# EAGLE design USBasp_SMD (EAGLE 7.5.0)
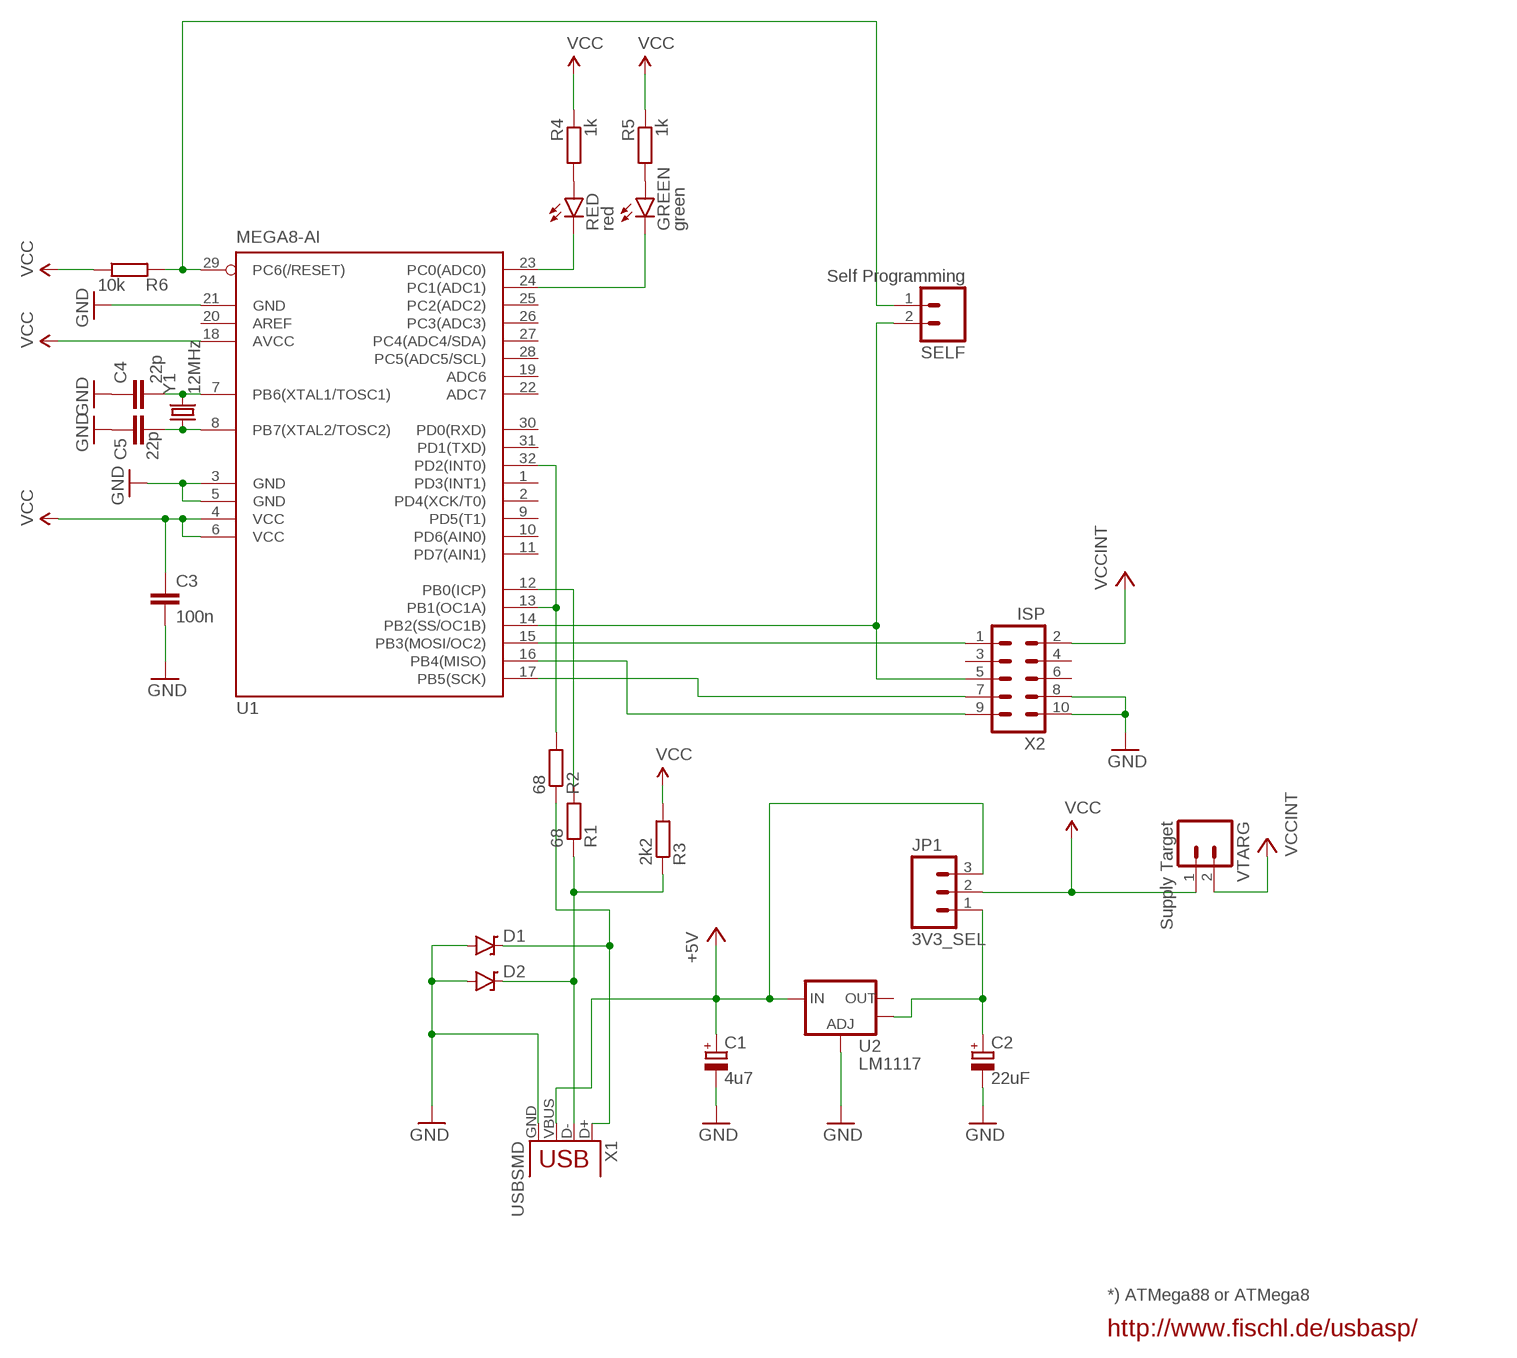
[diagram p0: schematic, sheet 1]

## Parts
C1  4u7  CPOL-EUE2.5-5  [E2,5-5]
C2  22uF  CPOL-EUE2.5-5  [E2,5-5]
C3  100n  C-EUC1206  [C1206]
C4  22p  C-EUC1206  [C1206]
C5  22p  C-EUC1206  [C1206]
D1  3V6  DIODE-ZENERPTH  [DIODE-ZENER]
D2  3V6  DIODE-ZENERPTH  [DIODE-ZENER]
GREEN  green  LED1206  [LED-1206]
JP1  3V3_SEL  M03PTH  [1X03]
R1  68  R-EU_M1206  [M1206]
R2  68  R-EU_M1206  [M1206]
R3  2k2  R-EU_M1206  [M1206]
R4  1k  R-EU_M1206  [M1206]
R5  1k  R-EU_M1206  [M1206]
R6  10k  R-EU_M1206  [M1206]
RED  red  LED1206  [LED-1206]
SELF  Self Programming  M02PTH  [1X02]
U1  MEGA8-AI  [TQFP32-08]
U2  LM1117  V_REG_LM1117SOT223  [SOT223]
VTARG  Supply Target  M02PTH  [1X02]
X1  USBSMD  [USB-MINIB]
X2  ISP  ML10L  [ML10L]
Y1  12MHz  CRYSTALSMD  [HC49UP]

## Nets
+5V: C1.+ JP1.3 U2.3(IN) X1.VBUS
GND: C1.- C2.- C3.2 C4.1 C5.1 D1.P$2(A) D2.P$2(A) U1.3(GND) U1.5(GND) U1.21(GND) U2.1(ADJ) X1.GND X2.8 X2.10
N$1: R6.2 SELF.1 U1.29(PC6(/RESET))
N$2: SELF.2 U1.14(PB2(SS/OC1B)) X2.5
N$3: U1.15(PB3(MOSI/OC2)) X2.1
N$4: U1.17(PB5(SCK)) X2.7
N$5: D2.P$1(C) R1.1 R3.1 X1.D-
N$6: U1.16(PB4(MISO)) X2.9
N$7: D1.P$1(C) R2.1 X1.D+
N$8: C2.+ JP1.1 U2.4(OUT)
N$10: R2.2 U1.13(PB1(OC1A)) U1.32(PD2(INT0))
N$11: R1.2 U1.12(PB0(ICP))
N$13: R4.2 RED.A
N$14: RED.C U1.23(PC0(ADC0))
N$15: GREEN.C U1.24(PC1(ADC1))
N$22: C4.2 U1.7(PB6(XTAL1/TOSC1)) Y1.2
N$23: C5.2 U1.8(PB7(XTAL2/TOSC2)) Y1.1
N$25: GREEN.A R5.2
VCC: C3.1 JP1.2 R3.2 R4.1 R5.1 R6.1 U1.4(VCC) U1.6(VCC) U1.18(AVCC) VTARG.1
VCCINT: VTARG.2 X2.2
Unconnected: U1.1(PD3(INT1)) U1.2(PD4(XCK/T0)) U1.9(PD5(T1)) U1.10(PD6(AIN0)) U1.11(PD7(AIN1)) U1.19(ADC6) U1.20(AREF) U1.22(ADC7) U1.25(PC2(ADC2)) U1.26(PC3(ADC3)) U1.27(PC4(ADC4/SDA)) U1.28(PC5(ADC5/SCL)) U1.30(PD0(RXD)) U1.31(PD1(TXD)) U2.2(OUT) X2.3 X2.4 X2.6

## Notes on the sheet
- *) ATMega88 or ATMega8
- http://www.fischl.de/usbasp/

## Library data of the parts
C1 C2 = rcl:CPOL-EU: POLARIZED CAPACITOR, European symbol
C3-C5 = rcl:C-EU: CAPACITOR, European symbol
D1 D2 = SparkFun-DiscreteSemi:DIODE-ZENER: Zener Diode Production Part - 8199 3.4V Zener Voltage
GREEN RED = SparkFun-LED:LED: LEDs Standard schematic elements and footprints for 5mm, 3mm, 1206, and 0603 sized LEDs. 5mm - Spark Fun Electronics SKU : COM-00529 (and others)
JP1 = SparkFun-Connectors:M03: Header 3 Standard 3-pin 0.1" header. Use with straight break away headers (SKU : PRT-00116), right angle break away headers (PRT-00553), swiss pins (PRT-00743), machine pins (PRT-00117), and female headers (PRT-00115). Molex polarized connector foot print use with SKU : PRT-08232 with associated crimp pins and housings.
R1-R6 = rcl:R-EU_: RESISTOR, European symbol
SELF VTARG = SparkFun-Connectors:M02: Standard 2-pin 0.1" header. Use with - straight break away headers ( PRT-00116) - right angle break away headers (PRT-00553) - swiss pins (PRT-00743) - machine pins (PRT-00117) - female headers (PRT-00115) Molex polarized connector foot print use with: PRT-08233 with associated crimp pins and housings. 2.54_SCREWTERM for use with PRT-10571. 3.5mm Screw Terminal footprints for PRT-08084 5mm Screw Terminal footprints for use with PRT-08432
U1 = atmel:MEGA8: MICROCONTROLLER 8 Kbytes FLASH, 1 kbytes SRAM, 512 bytes EEPROM, USART, 6-channel 10 bit ADC, 2-channel 8 bit ADC Pin compatible with Atmega48, ATMega88, ATMega168 Source: avr.lbr; MPN: ATMEGA8-16AU; OC_FARNELL: 9171371; OC_NEWARK: 73M8863
U2 = SparkFun-PowerIC:V_REG_LM1117: Voltage Regulator LM1117 Standard adjustable voltage regulator but in SMD form. Spark Fun Electronics SKU : COM-00595; PROD_ID: VREG-08170
X1 = SparkFun-Connectors:USB: USB Connectors USB-B-PTH is fully proven SKU : PRT-00139/CONN-08278 USB-miniB is fully proven SKU : PRT-00587 USB-A-PCB is untested. USB-A-H is throughly reviewed, but untested. Spark Fun Electronics SKU : PRT-00437 USB-B-SMT is throughly reviewed, but untested. Needs silkscreen touching up. USB-A-S has not been used/tested USB-MB-H has not been used/tested USB-MICROB has been used. CONN-09505; PROD_ID: CONN-08193
X2 = con-harting-ml:ML10: HARTING
Y1 = SparkFun-FreqCtrl:CRYSTAL: Various standard crystals. Proven footprints.

## Board
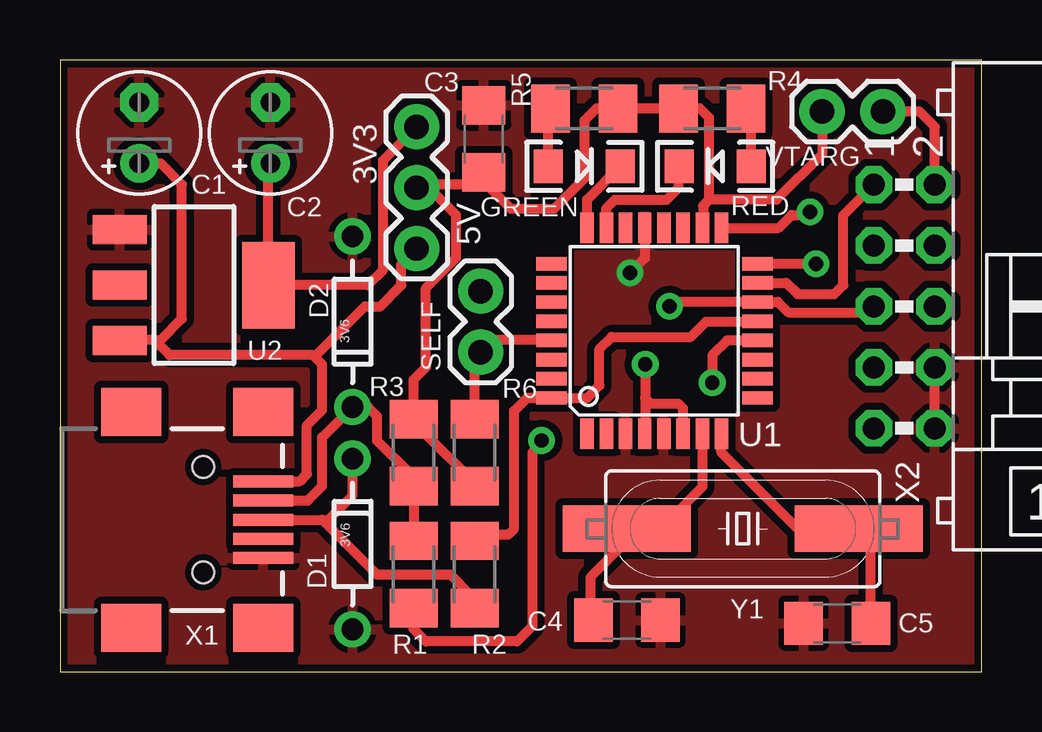
[diagram p1: board, top side]
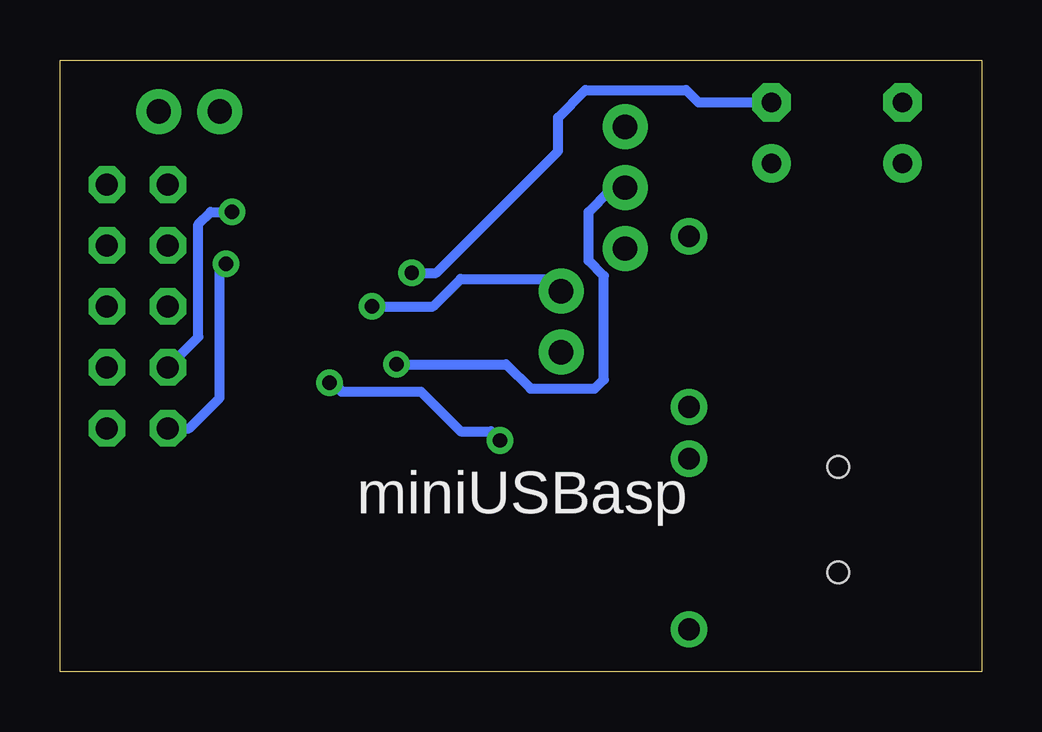
[diagram p2: board, bottom side, seen from below]

Size 38.41 x 25.52 mm. Coordinates in mm from the lower left corner, seen from the top.
Outline: 0,0 38.41,0 38.41,25.52 0,25.52 0,0
Copper layers (1*16): Top 0.035mm / dielectric 1.5mm / Bottom 0.035mm
Design rules "SparkFun": minimum track width 8mil, minimum drill 20mil, track to track 8mil, track to pad 8mil, pad to pad 8mil, via to via 8mil, smd to smd 8mil, copper to edge 8mil, drill to drill 8mil, minimum pad ring 12mil, minimum via ring 10mil, stop-mask expansion 4mil, vias tented up to drill 20mil, thermal gap 10mil

### Footprints (pad centres in the part's own frame; a part is rotated, then mirrored left to right if it is on the bottom)
E2,5-5 = drill 0.813 pad 1.6: + -1.27,0 | drill 0.813 pad 1.6 octagon: - 1.27,0
C1206 = smd 1.6 x 1.8: 1 -1.4,0; 2 1.4,0
DIODE-ZENER = drill 0.9: P$1 -3.556,0; P$2 3.556,0
LED-1206 = smd 1.2 x 1.4: A -1.5,0; C 1.5,0
1X03 = drill 1.016 pad 1.88: 1 0,0; 2 2.54,0; 3 5.08,0
M1206 = smd 1.6 x 2: 1 -1.4,0; 2 1.4,0
1X02 = drill 1.016 pad 1.88: 1 0,0; 2 2.54,0
TQFP32-08 = smd 1.27 x 0.559: 1 -4.293,2.8; 2 -4.293,2; 3 -4.293,1.2; 4 -4.293,0.4; 5 -4.293,-0.4; 6 -4.293,-1.2; 7 -4.293,-2; 8 -4.293,-2.8; 17 4.293,-2.8; 18 4.293,-2; 19 4.293,-1.2; 20 4.293,-0.4; 21 4.293,0.4; 22 4.293,1.2; 23 4.293,2; 24 4.293,2.8 | smd 0.559 x 1.27: 9 -2.8,-4.293; 10 -2,-4.293; 11 -1.2,-4.293; 12 -0.4,-4.293; 13 0.4,-4.293; 14 1.2,-4.293; 15 2,-4.293; 16 2.8,-4.293; 25 2.8,4.293; 26 2,4.293; 27 1.2,4.293; 28 0.4,4.293; 29 -0.4,4.293; 30 -1.2,4.293; 31 -2,4.293; 32 -2.8,4.293
SOT223 = smd 1.219 x 2.235: 1 -2.311,-3.099; 2 0,-3.099; 3 2.311,-3.099 | smd 3.6 x 2.2: 4 0,3.099
USB-MINIB = smd 2.5 x 0.5: D+ 2.5,0; D- 2.5,0.8; GND 2.5,-1.6; ID 2.5,-0.8; VBUS 2.5,1.6 | smd 2.5 x 2: MTN1 -3,4.5; MTN2 2.5,4.5; MTN3 -3,-4.5; MTN4 2.5,-4.5 | hole 0.9: 0,2.2; 0,-2.2
ML10L = drill 0.914 octagon: 1 -5.08,-1.27; 2 -5.08,1.27; 3 -2.54,-1.27; 4 -2.54,1.27; 5 0,-1.27; 6 0,1.27; 7 2.54,-1.27; 8 2.54,1.27; 9 5.08,-1.27; 10 5.08,1.27
HC49UP = smd 5.334 x 1.93: 1 -4.826,0; 2 4.826,0

### Placement (x,y rotation side)
C1  3.3,22.48 90 top
C2  8.76,22.48 90 top
C3  17.65,22.23 90 top
C4  23.62,2.16 180 top
C5  32.38,2.03 0 top
D1  12.19,5.33 270 top
D2  12.19,14.61 90 top
GREEN  21.84,21.08 0 top
JP1  14.86,22.73 270 top
R1  14.73,4.06 270 top
R2  17.27,4.06 90 top
R3  14.73,9.14 90 top
R4  27.18,23.5 0 top
R5  21.84,23.5 180 top
R6  17.27,9.14 90 top
RED  27.3,21.08 180 top
SELF  17.53,13.34 90 top
U1  24.77,14.22 90 top
U2  5.59,16.13 270 top
VTARG  31.75,23.37 0 top
X1  5.97,6.35 0 top
X2  35.18,15.24 270 top
Y1  28.45,5.97 180 top

### Tracks (layer width: path | path; a pad name or v marks a point on that pad's centre or on a via)
+5V
  Top 0.406: C1.+ 4.19,21.21 5.08,20.32 5.08,14.73 4.19,13.84 3.94,13.84 | 3.94,13.84 2.52,13.84 U2.3 | X1.VBUS 9.98,7.95 10.29,8.26 10.29,10.29 10.92,10.92 10.92,12.83 10.54,13.21 | 10.54,13.21 4.57,13.21 3.94,13.84 | 10.54,13.21 10.67,13.21 12.7,15.24 13.34,15.24 14.22,16.13 14.22,17.02 JP1.3
GND  (via drill 0.6)
  Top 0.406: X2.10 X2.8 | U1.21 24.36,17.25 v23.75,16.64
  Bottom 0.406: v23.75,16.64 22.73,16.64 17.65,21.72 17.65,23.11 16.51,24.26 12.32,24.26 11.81,23.75 C2.-
  pour Top (isolate 0.305): 0,0 38.35,0 38.35,0.13 38.35,25.53 0,25.53 0,25.4
N$1
  Top 0.406: U1.29 20.45,13.84 18.03,13.84 SELF.1 17.27,13.08 R6.2
N$2  (via drill 0.6)
  Top 0.406: v25.4,15.24 25.58,15.42 U1.14 29.91,15.42 30.35,14.99 33.66,14.99 X2.5
  Bottom 0.406: v25.4,15.24 22.86,15.24 21.72,16.38 18.03,16.38 SELF.2
N$3
  Top 0.406: U1.15 30.26,16.22 30.73,15.75 32.26,15.75 32.64,16.13 32.64,19.05 X2.1
N$4  (via drill 0.6)
  Top 0.406: U1.17 29.95,18.52 30.48,19.05 31.11,19.05 v31.24,19.18
  Bottom 0.406: X2.7 32.64,13.97 32.64,18.67 32.13,19.18 v31.24,19.18
N$5
  Top 0.406: R3.1 R1.1 | 14.48,8.13 14.48,8 R3.1 | X1.D- 10.32,7.15 10.92,7.75 10.92,9.78 D2.P$1 12.83,11.05 13.21,10.67 13.21,9.65 14.61,8.26 14.61,7.87 R3.1
N$6  (via drill 0.6)
  Top 0.406: U1.16 v31.49,17.02 v31.5,17.02
  Bottom 0.406: X2.9 33.02,10.16 31.75,11.43 31.75,16.76 v31.5,17.02
N$7
  Top 0.406: R2.1 17.14,2.79 17.14,3.17 16.26,4.06 13.21,4.06 10.92,6.35 | X1.D+ 10.92,6.35 | 10.92,6.35 11.18,6.35 12.19,7.37 D1.P$1
N$8
  Top 0.406: C2.+ 8.69,21.13 U2.4 12.83,16.13 13.46,16.76 13.46,21.34 JP1.1
N$10
  Top 0.406: U1.32 19.46,11.43 | 19.46,11.43 21.97,11.43 22.48,11.94 22.48,13.46 22.99,13.97 26.29,13.97 26.92,14.61 29.04,14.61 U1.13 | R2.2 17.78,5.46 18.03,5.71 18.67,5.71 18.92,5.97 18.92,10.89 19.46,11.43
N$11  (via drill 0.6)
  Top 0.406: U1.12 27.79,13.82 27.18,13.21 v27.18,12.06 | R1.2 14.73,1.78 15.24,1.27 19.05,1.27 19.68,1.91 19.68,9.14 20.07,9.53 v20.07,9.65
  Bottom 0.406: v27.18,12.06 27.05,12.06 26.67,11.68 23.37,11.68 21.72,10.03 20.45,10.03 v20.07,9.65
N$13
  Top 0.406: RED.A 28.8,23.39 R4.2
N$14
  Top 0.406: U1.23 22.77,19.34 23.11,19.68 25.27,19.68 25.78,20.19 25.78,21.06 RED.C
N$15
  Top 0.406: U1.24 21.96,19.7 GREEN.C
N$22
  Top 0.406: U1.7 26.77,7.71 25.4,6.35 24,6.35 Y1.2 23.62,5.46 22.1,3.94 22.1,2.28 C4.2
N$23
  Top 0.406: C5.2 33.78,5.46 Y1.1 30.73,5.97 27.56,9.14 U1.8
N$25
  Top 0.406: GREEN.A 20.34,23.52 R5.2
VCC  (via drill 0.6)
  Top 0.406: v24.38,12.83 24.38,11.43 | 24.38,11.43 24.38,9.95 U1.4 | U1.6 25.96,10.99 25.78,11.18 24.64,11.18 24.38,11.43 | VTARG.1 31.75,21.59 29.84,19.68 27.05,19.68 | 27.05,19.68 26.8,19.43 26.8,18.55 U1.18 | 17.78,20.32 18.8,19.3 20.57,19.3 21.84,20.57 21.84,22.99 22.35,23.5 R5.1 R4.1 26.67,23.5 27.05,23.11 27.05,19.68 | 17.78,20.32 17.78,20.7 C3.1 | R6.1 17.27,7.87 15.11,10.03 15.11,10.16 R3.2 14.73,12.19 15.24,12.7 15.24,16 16.51,17.27 16.51,19.05 15.24,20.32 | 15.24,20.32 14.99,20.32 JP1.2 | 17.78,20.32 15.24,20.32
  Bottom 0.406: v24.38,12.83 19.81,12.83 18.8,11.81 16.13,11.81 15.75,12.19 15.75,16.51 16.38,17.14 16.38,19.18 15.49,20.07 14.99,20.07 JP1.2
VCCINT
  Top 0.406: X2.2 36.45,22.73 35.81,23.37 VTARG.2

### Text on the board
bPlace: miniUSBasp
tNames: 3V3 | 5V